# EasyEDA Pro project 步进电机驱动器.eprj, schematic 1.2.1

## Sheets
1 主控: Board Name: Board2; Create Date: 2025-08-29; Page Name: 主控; Project Name: 步进电机驱动器; Schematic Name: Schematic2; Update Date: 2025-08-29; Company: 嘉立创EDA; Page Size: A4; Version: V1.0
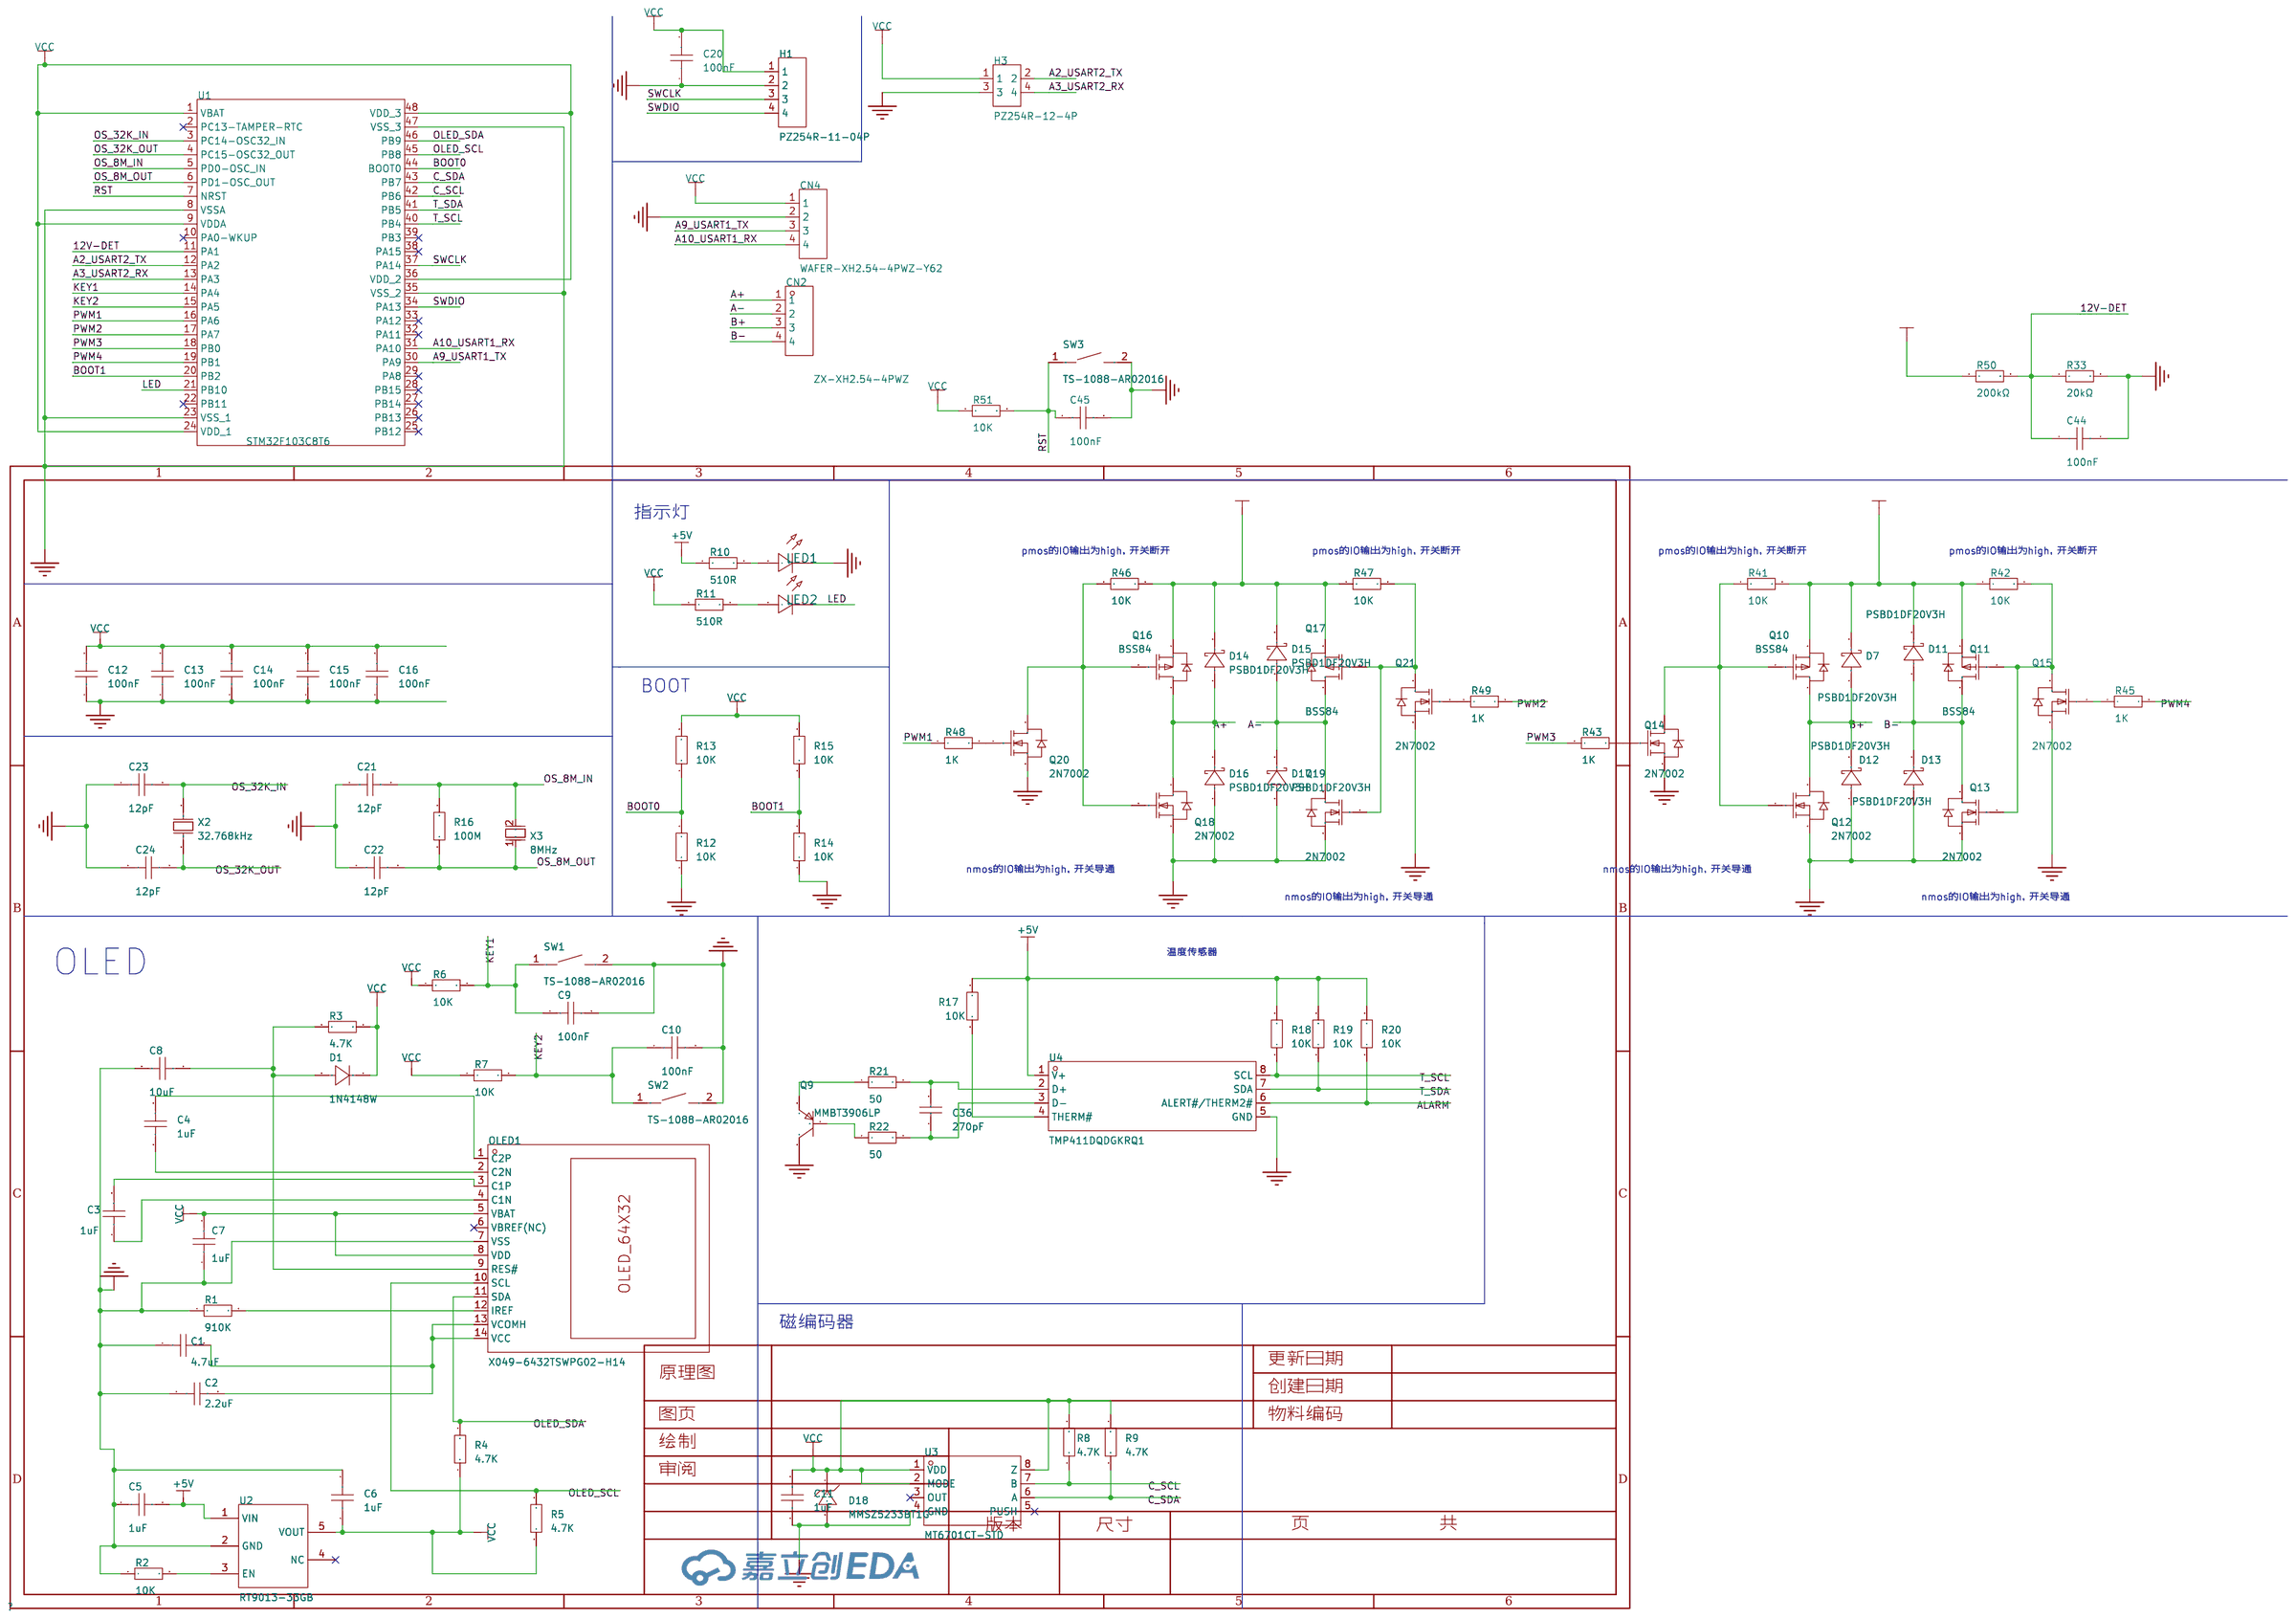
[diagram p2: 主控]
2 电源: Board Name: 1.1.2; Page Name: 电源
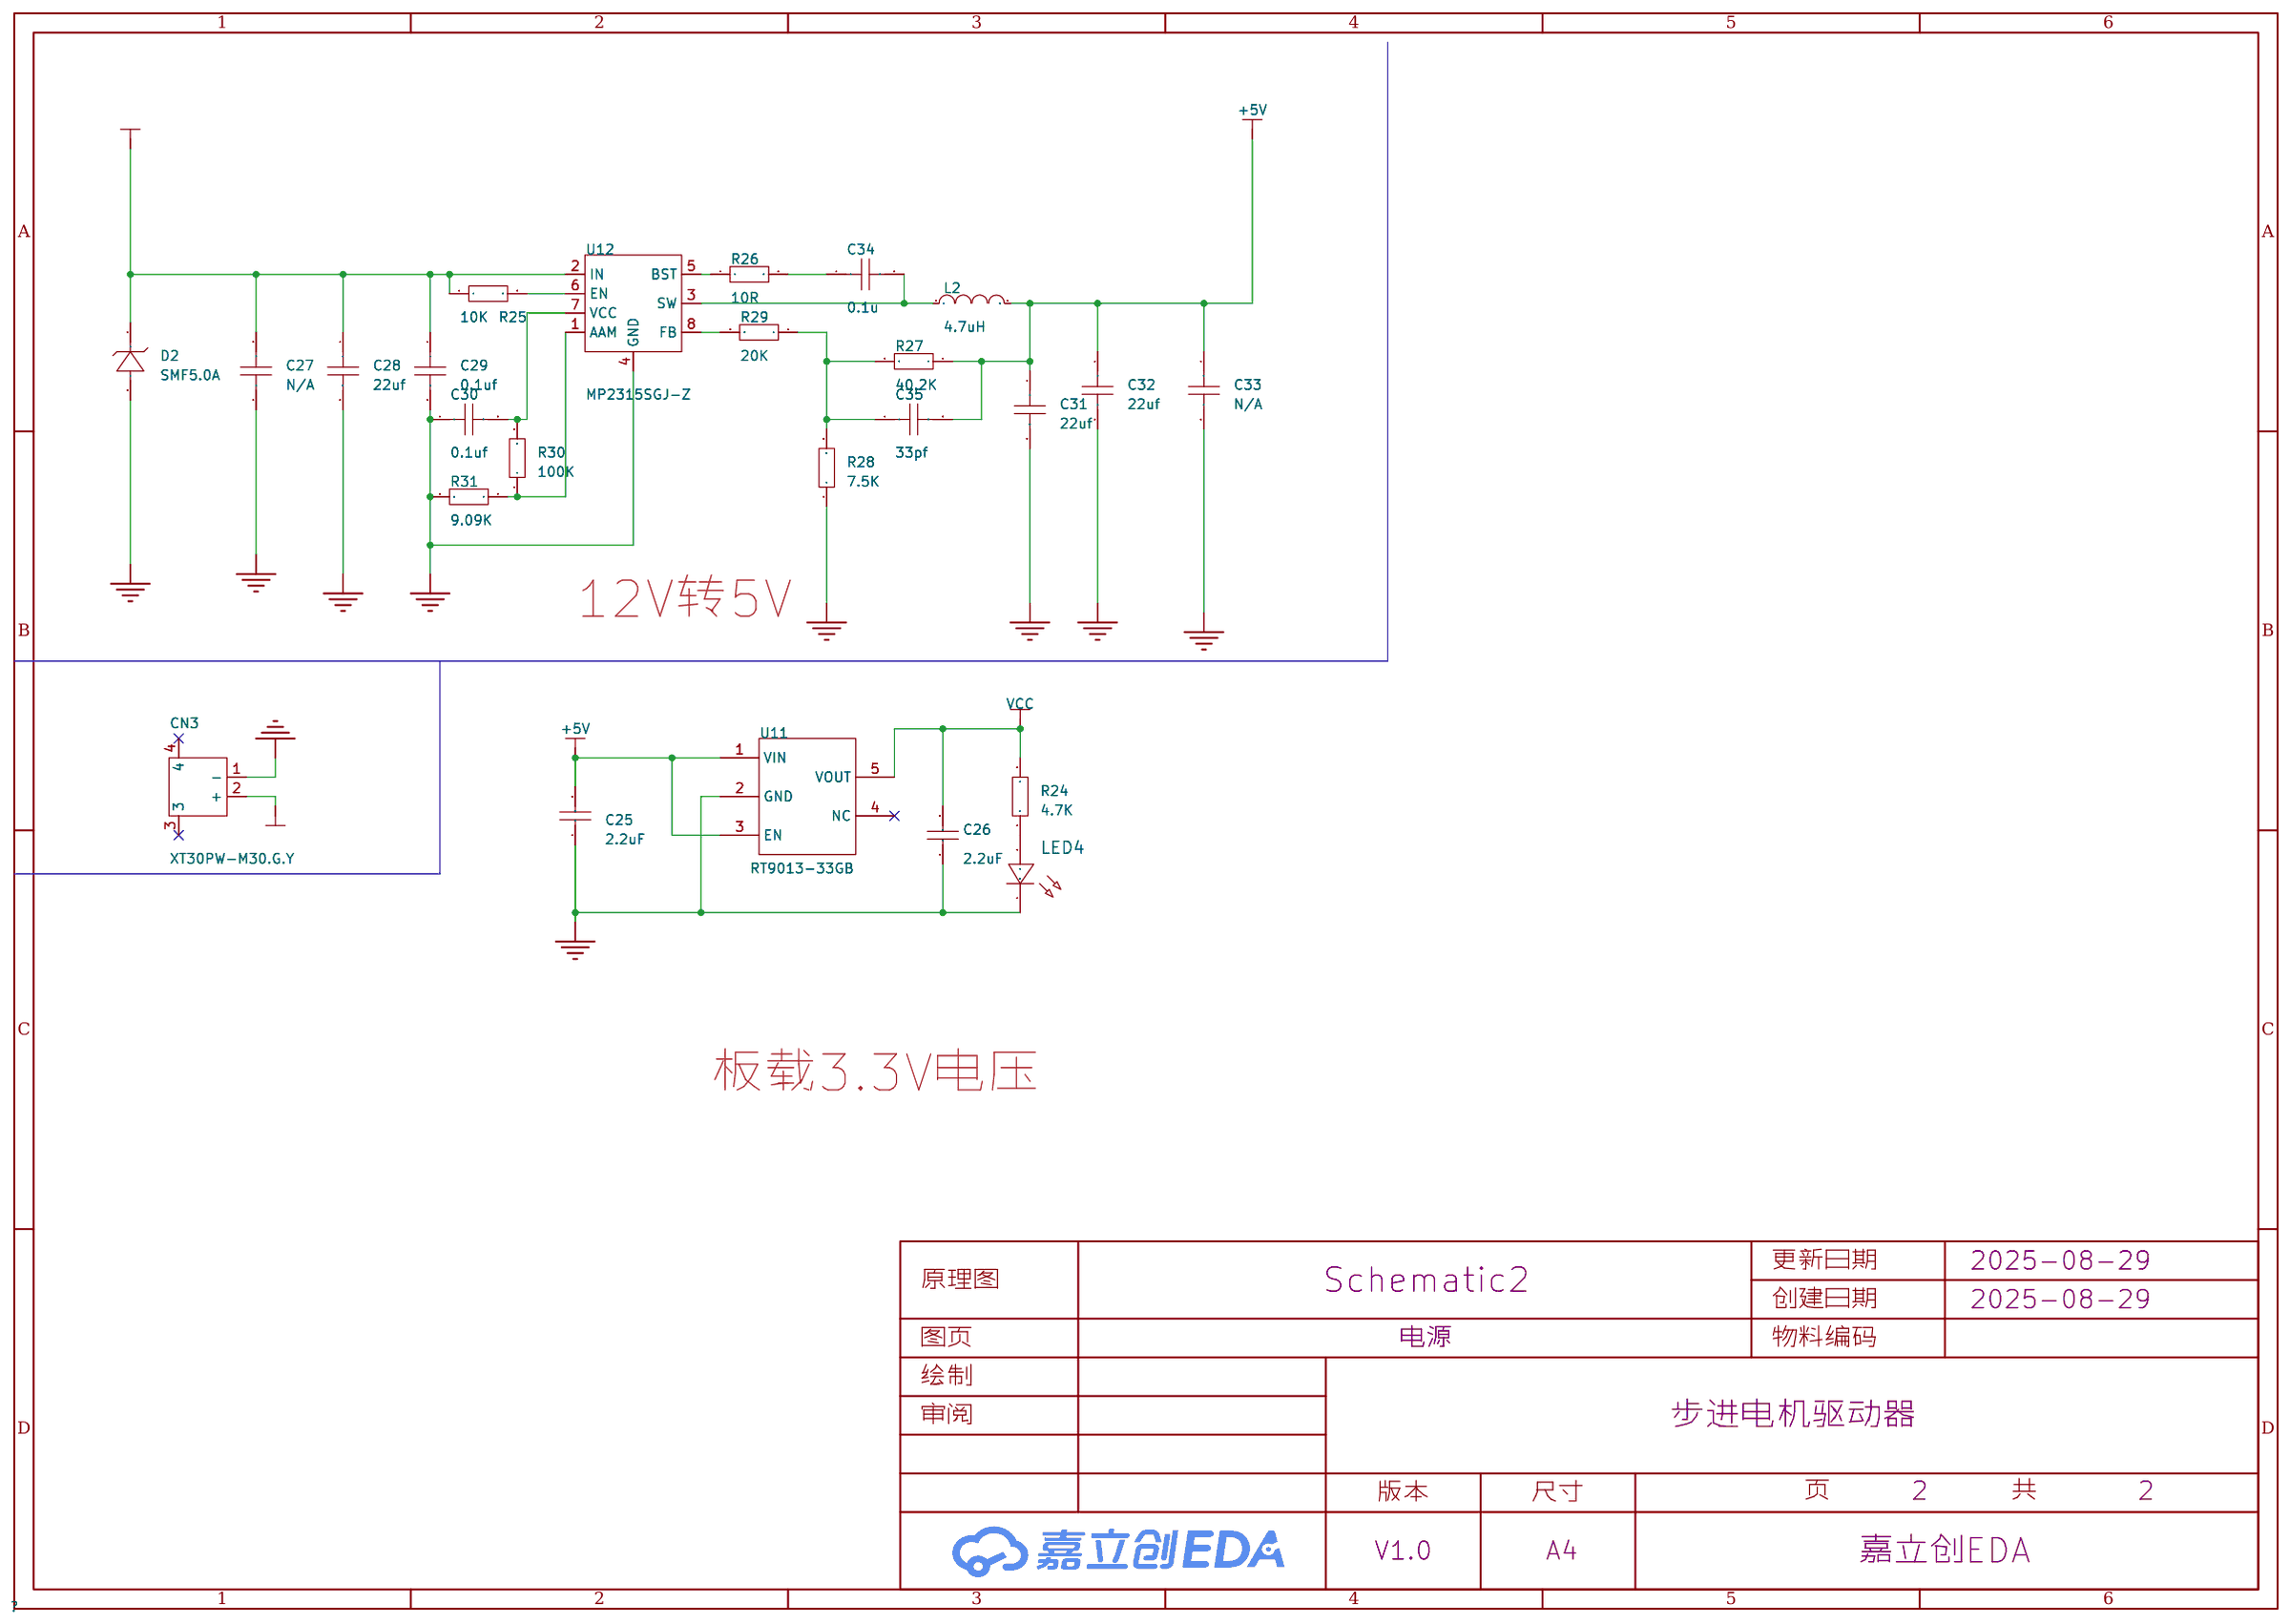
[diagram p3: 电源]

## Parts
sheet 主控
C1  4.7uF  [C0603]
C2  2.2uF  [C0603]
C3  1uF  [C0603]
C4  1uF  [C0603]
C5  1uF  [C0603]
C6  1uF  [C0603]
C7  1uF  [C0603]
C8  10uF  [C0603]
C9  100nF  [C0603]
C10  100nF  [C0603]
C11  1uF  [C0603]
C12  100nF  [C0603]
C13  100nF  [C0603]
C14  100nF  [C0603]
C15  100nF  [C0603]
C16  100nF  [C0603]
C20  100nF  [C0603]
C21  12pF  [C0603]
C22  12pF  [C0603]
C23  12pF  [C0603]
C24  12pF  [C0603]
C36  270pF  [C0603]
C44  100nF  [C0603]
C45  100nF  [C0603]
CN2  ZX-XH2.54-4PWZ  [CONN-TH_4P-P2.50_ZX-XH2.54-4PWZ]
CN4  WAFER-XH2.54-4PWZ-Y62  [CONN-TH_4P-P2.50_WAFER-XH2.54-4PWZ]
D1  1N4148W  [SOD-123_L2.7-W1.6-LS3.8-RD]
D7  PSBD1DF20V3H  [SOD-123F_L2.8-W1.8-LS3.7-RD]
D11  PSBD1DF20V3H  [SOD-123F_L2.8-W1.8-LS3.7-RD]
D12  PSBD1DF20V3H  [SOD-123F_L2.8-W1.8-LS3.7-RD]
D13  PSBD1DF20V3H  [SOD-123F_L2.8-W1.8-LS3.7-RD]
D14  PSBD1DF20V3H  [SOD-123F_L2.8-W1.8-LS3.7-RD]
D15  PSBD1DF20V3H  [SOD-123F_L2.8-W1.8-LS3.7-RD]
D16  PSBD1DF20V3H  [SOD-123F_L2.8-W1.8-LS3.7-RD]
D17  PSBD1DF20V3H  [SOD-123F_L2.8-W1.8-LS3.7-RD]
D18  MMSZ5233BT1G  [SOD-123_L2.7-W1.6-LS3.7-RD]
H1  PZ254R-11-04P  [HDR-TH_4P-P2.54-H-M-W10.4]
H3  PZ254R-12-4P  [HDR-TH_4P-P2.54-H-M-R2-C2-S2.54]
LED1  -  [LED_0603]
LED2  -  [LED_0603]
OLED1  X049-6432TSWPG02-H14  [OLED-SMD_X049-6432TSWPG02-H14]
Q9  MMBT3906LP  [X1-DFN1006-3_L1.0-W0.6-P0.35-BR]
Q10  BSS84  [SOT-23-3_L2.9-W1.3-P1.90-LS2.4-BR-1]
Q11  BSS84  [SOT-23-3_L2.9-W1.3-P1.90-LS2.4-BR-1]
Q12  2N7002  [SOT-23-3_L2.9-W1.3-P1.90-LS2.4-BR]
Q13  2N7002  [SOT-23-3_L2.9-W1.3-P1.90-LS2.4-BR]
Q14  2N7002  [SOT-23-3_L2.9-W1.3-P1.90-LS2.4-BR]
Q15  2N7002  [SOT-23-3_L2.9-W1.3-P1.90-LS2.4-BR]
Q16  BSS84  [SOT-23-3_L2.9-W1.3-P1.90-LS2.4-BR-1]
Q17  BSS84  [SOT-23-3_L2.9-W1.3-P1.90-LS2.4-BR-1]
Q18  2N7002  [SOT-23-3_L2.9-W1.3-P1.90-LS2.4-BR]
Q19  2N7002  [SOT-23-3_L2.9-W1.3-P1.90-LS2.4-BR]
Q20  2N7002  [SOT-23-3_L2.9-W1.3-P1.90-LS2.4-BR]
Q21  2N7002  [SOT-23-3_L2.9-W1.3-P1.90-LS2.4-BR]
R1  910K  [R0603]
R2  10K  [R0603]
R3  4.7K  [R0603]
R4  4.7K  [R0603]
R5  4.7K  [R0603]
R6  10K  [R0603]
R7  10K  [R0603]
R8  4.7K  [R0603]
R9  4.7K  [R0603]
R10  510R  [R0603]
R11  510R  [R0603]
R12  10K  [R0603]
R13  10K  [R0603]
R14  10K  [R0603]
R15  10K  [R0603]
R16  100M  [R0603]
R17  10K  [R0603]
R18  10K  [R0603]
R19  10K  [R0603]
R20  10K  [R0603]
R21  50  [R0603]
R22  50  [R0603]
R33  20kΩ  [R0603]
R41  10K  [R0603]
R42  10K  [R0603]
R43  1K  [R0603]
R45  1K  [R0603]
R46  10K  [R0603]
R47  10K  [R0603]
R48  1K  [R0603]
R49  1K  [R0603]
R50  200kΩ  [R0603]
R51  10K  [R0603]
SW1  TS-1088-AR02016  [SW-SMD_L3.9-W3.0-P4.45]
SW2  TS-1088-AR02016  [SW-SMD_L3.9-W3.0-P4.45]
SW3  TS-1088-AR02016  [SW-SMD_L3.9-W3.0-P4.45]
U1  STM32F103C8T6  [LQFP-48_L7.0-W7.0-P0.50-LS9.0-BL]
U2  RT9013-33GB  [SOT-23-5_L3.0-W1.7-P0.95-LS2.8-BL]
U3  MT6701CT-STD  [SOP-8_L4.9-W3.9-P1.27-LS6.0-BL]
U4  TMP411DQDGKRQ1  [VSSOP-8_L3.0-W3.0-P0.65-LS4.9-BL]
X2  32.768kHz  [CRYSTAL-SMD_L3.2-W1.5-1]
X3  8MHz  [OSC-SMD_2P-L3.2-W2.5]
sheet 电源
C25  2.2uF  [C0603]
C26  2.2uF  [C0603]
C27  N/A  [C0603]
C28  22uf  [C0603]
C29  0.1uf  [C0603]
C30  0.1uf  [C0603]
C31  22uf  [C0603]
C32  22uf  [C0603]
C33  N/A  [C0603]
C34  0.1u  [C0603]
C35  33pf  [C0603]
CN3  XT30PW-M30.G.Y  [CONN-TH_XT30PW-M]
D2  SMF5.0A  [SOD-123FL_L2.7-W1.8-LS3.8-RD]
L2  4.7uH  [IND-SMD_L4.4-W4.2]
LED4  -  [LED_0603]
R24  4.7K  [R0603]
R25  10K  [R0603]
R26  10R  [R0603]
R27  40.2K  [R0603]
R28  7.5K  [R0603]
R29  20K  [R0603]
R30  100K  [R0603]
R31  9.09K  [R0603]
U11  RT9013-33GB  [SOT-23-5_L3.0-W1.7-P0.95-LS2.8-BL]
U12  MP2315SGJ-Z  [TSOT-23-8_L2.9-W1.6-P0.65-LS2.8-BL]

## Library data of the parts
C1-C16 C20-C24 C27-C35 C45 = CAP_0603: Supplier Footprint: 0603
C36 = 0603B271K500NT: 容值:270pF;精度:±10%;额定电压:50V;温度系数:X7R;; LCSC Part Name: 270pF ±10% 50V; Supplier Part: C1608; Manufacturer: FH(风华); Supplier Footprint: 0603; JLCPCB Part Class: 扩展库; Datasheet: https://atta.szlcsc.com/upload/public/pdf/source/20200305/C486355_26A10D38EF8C2A5C37091D0039909270.pdf; Supplier: LCSC; Tolerance: ±10%; Voltage Rating: 50V; Temperature Coefficient: X7R
C44 = CGA0603X7R104K500JT: 容值:100nF;精度:±10%;额定电压:50V;材质(温度系数):X7R;; LCSC Part Name: 100nF ±10% 50V; Supplier Part: C6119867; Manufacturer: HRE(芯声); Supplier Footprint: 0603; JLCPCB Part Class: 扩展库; Supplier: LCSC; Tolerance: ±10%; Voltage Rated: 50V; Temperature Coefficient: X7R
CN2 = ZX-XH2.54-4PWZ: LCSC Part Name: 1x4P 间距:2.5mm 弯插 系列:XH; Supplier Part: C7429643; Manufacturer: Megastar(兆星); Supplier Footprint: 弯插,P=2.5mm; JLCPCB Part Class: 扩展库; Datasheet: https://atta.szlcsc.com/upload/public/pdf/source/20230619/8DC602C7BA46C153FF1BE89D90453879.pdf; Supplier: LCSC; Pins Structure: 1x4P; Pitch: 2.5mm; Mounting Type: 弯插; Reference Series: XH; Number of Pins: 4P; Number of Rows: 1; Number of PINs Per Row: 4; Current Rating: 3A; Contact Material: 黄铜; Contact Plating: 锡; Operating Temperature: -25℃~+85℃; Voltage Rating: 250V; Plastic Material: PA66; Flame Retardant Rating: UL94V-0; Color: 白色; Z-Height of the Board: 5.9mm; X-Length of Bottom Edge on Board (Spacing Line): 12.5mm; Y-Width of Bottom Edge on Board: 7.32mm
CN4 = WAFER-XH2.54-4PWZ-Y62: LCSC Part Name: 1x4P 间距:2.5mm 弯插 系列:XH; Supplier Part: C42441204; Manufacturer: XUNPU(讯普); Supplier Footprint: 弯插,P=2.5mm; Datasheet: https://item.szlcsc.com/datasheet/WAFER-XH2.54-4PWZ-Y62/44489235.html; Supplier: LCSC; Pins Structure: 1x4P; Pitch: 2.5mm; Mounting Type: 弯插; Reference Series: XH; Number of Pins: 4P; Number of Rows: 1; Number of PINs Per Row: 4; Current Rating: 3A; Contact Material: 铜合金; Contact Plating: 锡; Operating Temperature: -25℃~+85℃; Voltage Rating: 250V; Plastic Material: PA66; Flame Retardant Rating: UL94V-2; Color: 米色; Z-Height of the Board: 5.75mm; X-Length of Bottom Edge on Board (Spacing Line): 12.5mm; Y-Width of Bottom Edge on Board: 7.17mm
D1 = 1N4148W_C909967: 二极管配置:独立式;正向压降(Vf):1.25V@150mA;直流反向耐压(Vr):100V;整流电流:-;反向恢复时间(Trr):-;; LCSC Part Name: 电压:100V 电流:150mA; Supplier Part: C909967; Manufacturer: GOODWORK(固得沃克); Supplier Footprint: SOD-123; JLCPCB Part Class: 扩展库; Datasheet: https://atta.szlcsc.com/upload/public/pdf/source/20240802/BA80D71F54142D28B058A528BF89B76A.pdf; Supplier: LCSC; Diode Configuration: 独立式; Voltage - Forward(Vf@If): 1.25V@150mA; Voltage - DC Reverse(Vr): 100V; Reverse Leakage Current (Ir): 1uA@100V; Operating Temperature: -55℃~+150℃@(Tj)
D7 D11-D17 = PSBD1DF20V3H: Supplier Part: C110729; Manufacturer: Prisemi(芯导); Supplier Footprint: SOD-123F; JLCPCB Part Class: Extended Part; Datasheet: https://item.szlcsc.com/datasheet/PSBD1DF20V3H/111954.html; Supplier: LCSC; Voltage - Forward(Vf@If): 550mV@1A; Voltage - DC Reverse(Vr): 20V; Current - Rectified: 3A; Reverse Leakage Current (Ir): 500uA@20V; Operating Junction Temperature Range: -55℃~+150℃@(Tj); Non-Repetitive Peak Forward Surge Current: 80A
D18 = MMSZ5233BT1G: Supplier Part: C145506; Manufacturer: onsemi(安森美); Supplier Footprint: SOD-123; JLCPCB Part Class: 扩展库; Datasheet: https://item.szlcsc.com/datasheet/MMSZ5233BT1G/156838.html; Supplier: LCSC; Diode Configuration: 独立式; Zener Voltage(Nom): 6V; Reverse Leakage Current (Ir): 5uA@3.5V; Zener Voltage(Range): 5.7V~6.3V; Pd - Power Dissipation: 500mW; Impedance(Zzt): 7Ω; Impedance(Zzk): 1.6kΩ; Operating Junction Temperature Range: -55℃~+150℃
H1 = PZ254R-11-04P: 插针结构:1x4P;间距:2.54mm;行距:-;圆针/方针:方针;安装方式:弯插;排数:单排;总PIN位数:4P;额定电流:-;额定电压:-;配合针长度:6mm;塑高:2.5mm;触头材质:黄铜;触头镀层:-;工作温度:-40℃~+105℃;颜色:黑色;; LCSC Part Name: 1x4P 间距:2.54mm 方针 弯插; Supplier Part: C492412; Manufacturer: XFCN(兴飞); Supplier Footprint: 弯插,P=2.54mm; JLCPCB Part Class: 扩展库; Datasheet: https://atta.szlcsc.com/upload/public/pdf/source/20200309/C492412_B0EFFC1946AB079B8871416C4A09EF6C.pdf; Supplier: LCSC; Pin Structure: 1x4P; Pitch: 2.54mm; Circluar Pins/Square Pins: 方针; Mounting Type: 弯插; Number of Rows: 单排; Number of Pins: 4P; Length of Mating Pin: 6mm; Insulation Height: 2.5mm; Contact Material: 黄铜; Operating Temperature: -40℃~+105℃; Color: 黑色
H3 = PZ254R-12-4P: 插针结构:2x2P;间距:2.54mm;行距:2.54mm;圆针/方针:方针;安装方式:弯插;排数:双排;总PIN位数:4P;额定电流:-;额定电压:-;配合针长度:6mm;塑高:2.5mm;触头材质:黄铜;触头镀层:-;工作温度:-40℃~+105℃;颜色:黑色;; LCSC Part Name: 2x2P 间距:2.54mm 方针 弯插; Supplier Part: C492430; Manufacturer: XFCN(兴飞); Supplier Footprint: 弯插,P=2.54mm; JLCPCB Part Class: 扩展库; Datasheet: https://atta.szlcsc.com/upload/public/pdf/source/20200309/C492430_40F61060098E2A512B5822C8CF53ABE1.pdf; Supplier: LCSC; Pin Structure: 2x2P; Pitch: 2.54mm; Row Spacing: 2.54mm; Circluar Pins/Square Pins: 方针; Mounting Type: 弯插; Number of Rows: 双排; Number of Pins: 4P; Length of Mating Pin: 6mm; Insulation Height: 2.5mm; Contact Material: 黄铜; Operating Temperature: -40℃~+105℃; Color: 黑色
LED1 LED2 LED4 = LED_0603-R: Supplier Footprint: 0603
OLED1 = X049-6432TSWPG02-H14: 显示屏; Supplier Part: C18723009; Manufacturer: Newvision(新智景); JLCPCB Part Class: 扩展库; Datasheet: https://atta.szlcsc.com/upload/public/pdf/source/20231103/4FD7F1160504D84EC5B2CD699B288E83.pdf; Supplier: LCSC
Q9 = MMBT3906LP: 晶体管类型:PNP;集电极电流(Ic):200mA;集射极击穿电压(Vceo):40V;耗散功率(Pd):200mW;直流电流增益(hFE):300@10mA,1V;; LCSC Part Name: PNP 电流:200mA 电压:40V; Supplier Part: C19089401; Manufacturer: YONGYUTAI(永裕泰); Supplier Footprint: DFN1006-3L; JLCPCB Part Class: 扩展库; Datasheet: https://item.szlcsc.com/datasheet/MMBT3906LP/20296712.html; Supplier: LCSC; type: PNP; Current - Collector(Ic): 200mA; Collector - Emitter Voltage VCEO: 40V; Pd - Power Dissipation: 200mW; DC Current Gain: 300@10mA,1V; Transition frequency(fT): 300MHz; Current - Collector Cutoff: 100nA; Vce Saturation(VCE(sat)): 300mV@50mA,5mA; Operating Temperature: -55℃~+150℃; Emitter-Base Voltage(Vebo): 5V; Number: 1个PNP
Q10 Q11 Q16 Q17 = BSS84_C7420340: LCSC Part Name: P沟道,电流:-0.17A,耐压:-60V; Supplier Part: C7420340; Manufacturer: 宏嘉诚; Supplier Footprint: SOT-23; JLCPCB Part Class: 扩展库; Datasheet: https://atta.szlcsc.com/upload/public/pdf/source/20250624/B9A20CA6774225BD9E2FC0CF094F2968.pdf; Supplier: LCSC; Number: 1个P沟道; Drain to Source Voltage: 60V; Current - Continuous Drain(Id): 170mA; RDS(on): 3.3Ω@10V；3.5Ω@4.5V; Pd - Power Dissipation: 680mW; Gate Threshold Voltage (Vgs(th)): 1.4V@250uA; Gate Charge(Qg): 1.77nC@10V; Input Capacitance(Ciss): 43pF; Reverse Transfer Capacitance (Crss@Vds): 2.8pF; Operating Temperature: -55℃~+150℃; Type: P沟道; Output Capacitance(Coss): 2.9pF
Q12-Q15 Q18-Q21 = 2N7002_C7420321: LCSC Part Name: N沟道,电流:115mA,耐压:60V; Supplier Part: C7420321; Manufacturer: 宏嘉诚; Supplier Footprint: SOT-23; JLCPCB Part Class: 扩展库; Datasheet: https://atta.szlcsc.com/upload/public/pdf/source/20250624/B1032C791A504786E484C5C5C9138B03.pdf; Supplier: LCSC; Number: 1个N沟道; Drain to Source Voltage: 60V; Current - Continuous Drain(Id): 115mA; RDS(on): 900mΩ@10V; Pd - Power Dissipation: 225mW; Gate Threshold Voltage (Vgs(th)): 1.6V@250uA; Gate Charge(Qg): 1.6nC@10V; Input Capacitance(Ciss): 50pF; Reverse Transfer Capacitance (Crss@Vds): 5pF; Operating Temperature: -55℃~+150℃; Type: N沟道; Output Capacitance(Coss): 25pF
R1-R22 R24-R31 R41-R43 R45-R49 R51 = Res_0603: Supplier Footprint: 0603
R33 = 0603WAF2002T5E: 电阻类型:厚膜电阻;阻值:20kΩ;精度:±1%;功率:100mW;最大工作电压:75V;温度系数:±100ppm/℃;; LCSC Part Name: 20kΩ ±1% 100mW 厚膜电阻; Supplier Part: C4184; Manufacturer: UNI-ROYAL(厚声); Supplier Footprint: 0603; JLCPCB Part Class: 基础库; Datasheet: https://atta.szlcsc.com/upload/public/pdf/source/20200306/C422600_1E6D84923E4A46A82E41ADD87F860B5C.pdf; Supplier: LCSC; Type: 厚膜电阻; Tolerance: ±1%; Power(Watts): 100mW; Overload Voltage (Max): 75V; Temperature Coefficient: ±100ppm/℃; Operating Temperature Range: -55℃~+155℃
R50 = 0603WAF2003T5E: 电阻类型:厚膜电阻;阻值:200kΩ;精度:±1%;功率:100mW;最大工作电压:75V;温度系数:±100ppm/℃;; LCSC Part Name: 200kΩ ±1% 100mW 厚膜电阻; Supplier Part: C25811; Manufacturer: UNI-ROYAL(厚声); Supplier Footprint: 0603; JLCPCB Part Class: 基础库; Datasheet: https://atta.szlcsc.com/upload/public/pdf/source/20200306/C422600_1E6D84923E4A46A82E41ADD87F860B5C.pdf; Supplier: LCSC; Type: 厚膜电阻; Tolerance: ±1%; Power(Watts): 100mW; Overload Voltage (Max): 75V; Temperature Coefficient: ±100ppm/℃; Operating Temperature Range: -55℃~+155℃
SW1-SW3 = TS-1088-AR02016: 电路结构:单刀单掷;按钮形状:圆形按钮;作用力:160gf;安装方式:立贴;开关长度:4mm;开关宽度:3mm;开关高度:2mm;带支架:不带;触点电流:50mA;额定电压(DC):12V;绝缘电阻:100MΩ;机械寿命:10万次;; LCSC Part Name: 4*3*2mm 立贴 轻触开关; Supplier Part: C720477; Manufacturer: XUNPU(讯普); Supplier Footprint: SMD; JLCPCB Part Class: 基础库; Datasheet: https://atta.szlcsc.com/upload/public/pdf/source/20200810/C720475_60D09DD6C54279ADDB2DC25100F1CC11.pdf; Supplier: LCSC; Circuit: 单刀单掷; Actuator Style: 圆形按钮; Operating Force: 160gf; Mounting Style: 立贴; Switch Length: 4mm; Switch Width: 3mm; Switch Height: 2mm; Strike Gundam: 不带; Contact Current: 50mA; Voltage Rating (DC): 12V; Insulation Resistance: 100MΩ; Actuator/Cap Color: 黑色; Pin Style: SMD接片; Mechanical Life: 10万次; Operating Temperature: -30℃~+80℃
U1 = STM32F103C8T6: CPU内核:ARM-M3;CPU最大主频:72MHz;应用领域:-;; LCSC Part Name: 主流增强型ARM Cortex-M3 MCU，具有64 KB Flash、72 MHz CPU、电机控制、USB和CAN; Supplier Part: C8734; Manufacturer: ST(意法半导体); Supplier Footprint: LQFP-48(7x7); JLCPCB Part Class: 扩展库; Datasheet: https://item.szlcsc.com/datasheet/STM32F103C8T6/9243.html; Supplier: LCSC; CPU Core: ARM-M3; CPU Maximum Speed: 72MHz; Program Storage Size: 64KB; Program Memory Type: FLASH; Number of I/O: 37; ADC (Bit): 12bit; Voltage - Supply: 2V~3.6V
U2 = RT9013-33GB: 输出类型:固定;工作电压:5.5V;输出电压:3.3V;输出电流:500mA;电源纹波抑制比(PSRR):50dB@(10kHz);输出极性:正极;; LCSC Part Name: 输入5.5V 输出3.3V 500mA; Supplier Part: C47773; Manufacturer: RICHTEK(立锜); Supplier Footprint: SOT-23-5; JLCPCB Part Class: 扩展库; Datasheet: https://atta.szlcsc.com/upload/public/pdf/source/20150504/1457707282459.pdf; Supplier: LCSC; Output Type: 固定; Voltage - Supply: 5.5V; Output Voltage: 3.3V; Output Current: 500mA; Power Supply Rejection Ratio (PSRR): 50dB@(10kHz); Voltage Dropout: 400mV@(500mA); standby current: 25uA; Noise: 30uVrms; Features: 带使能；过热保护；过流保护; Operating Temperature: -40℃~+125℃@(Tj); Output Configuration: 正极; Number of Outputs: 1
U3 = MT6701CT-STD_C5451785: Supplier Part: C5451785; Manufacturer: MagnTek(麦歌恩); Supplier Footprint: SOP-8; JLCPCB Part Class: 扩展库; Datasheet: https://item.szlcsc.com/datasheet/MT6701CT-STD/6356029.html; Supplier: LCSC
U4 = TMP411DQDGKRQ1: TMP411-Q1 具有 N 因数和串联电阻校正的汽车级、远程和本地温度传感器; Supplier Part: C2859856; Manufacturer: TI(德州仪器); Supplier Footprint: VSSOP-8-0.65mm; JLCPCB Part Class: 扩展库; Datasheet: https://www.ti.com/cn/lit/gpn/tmp411-q1; Supplier: LCSC
X2 = CM7V-T1A-LOW-ESR-32.768K-12.5PF-20-TA-QC: 频率:32.768kHz;常温频差:±20ppm;负载电容:12.5pF;频率稳定度:-;; LCSC Part Name: CM7V-T1A LOW ESR 32.768K 12.5PF 20 TA QC; Supplier Part: C27152053; Manufacturer: Micro Crystal(瑞士微晶); Supplier Footprint: SMD3215; JLCPCB Part Class: 扩展库; Datasheet: https://www.microcrystal.com/fileadmin/Media/Products/32kHz/Datasheet/CM7V-T1A_Low-ESR.pdf; Supplier: LCSC; Normal temperature Frequency Tolerance: ±20ppm; Load Capacitance: 12.5pF; Operating Temperature: -40℃~+85℃
X3 = A308000003: 晶振类型:贴片晶振;频率:8MHz;常温频差:±30ppm;负载电容:12pF;; LCSC Part Name: FL:8M CL:12.0 FT:30 OP:-40TO~125 ST:100 CI:300 DL:10(100Max); Supplier Part: C409345; Manufacturer: TXC(晶技); Supplier Footprint: SMD3225; JLCPCB Part Class: 扩展库; Datasheet: https://atta.szlcsc.com/upload/public/pdf/source/20240312/351197091BF4DB9A6E687BFC8ED82776.pdf; Supplier: LCSC; Type: 贴片晶振; Normal temperature Frequency Tolerance: ±30ppm; Load Capacitance: 12pF; Equivalent Series Resistance(ESR): 300Ω; Operating Temperature: -40℃~+125℃
C25 C26 = 0603B104K500NT: 容值:100nF;精度:±10%;额定电压:50V;材质(温度系数):X7R;; LCSC Part Name: 100nF ±10% 50V; Supplier Part: C30926; Manufacturer: FH(风华); Supplier Footprint: 0603; JLCPCB Part Class: 扩展库; Datasheet: https://atta.szlcsc.com/upload/public/pdf/source/20170923/C30926_1506149436298988724.pdf; Supplier: LCSC; Tolerance: ±10%; Voltage Rated: 50V; Temperature Coefficient: X7R
CN3 = XT30PW-M30.G.Y: 类别:-;类型1:-;; LCSC Part Name: AMASS(艾迈斯)航模插头 卧式弯脚 XT30PW-M公头; Supplier Part: C431092; Manufacturer: AMASS(艾迈斯); JLCPCB Part Class: 扩展库; Datasheet: https://item.szlcsc.com/datasheet/XT30PW-M30.G.Y/426930.html; Supplier: LCSC; Type: 航模插头; RatedVoltage: DC 500V; InterfaceType: 公头; RatedCurrent: 15A; RecommendedWireGauge: 16/18/20AWG; contact resistance: 1.2mΩ; specifications: 2pin
D2 = SMF5.0A_C19077497: 极性:单向;反向截止电压(Vrwm):5V;最大钳位电压:7.3V;峰值脉冲电流(Ipp):27.4A;峰值脉冲功率(Ppp):200W;击穿电压:6.4V;; Supplier Part: C19077497; Manufacturer: 宏迦橙; Supplier Footprint: SOD-123FL; JLCPCB Part Class: 扩展库; Datasheet: https://atta.szlcsc.com/upload/public/pdf/source/20231129/4813F17DC56F8B344A8D004597B3633C.pdf; Supplier: LCSC; polarity: 单向; Reverse Stand-Off Voltage (Vrwm): 5V; Maximum Clamping Voltage: 7.3V; Peak Pulse Current (Ipp): 27.4A; Peak Pulse Power Dissipation (Ppp): 200W; Breakdown Voltage: 6.4V; Reverse Leakage Current (Ir): 400uA; Number of Lines: 单路; Operating Temperature: -55℃~+155℃; Type: TVS
L2 = FXL0420-4R7-M: 电感值:4.7uH;精度:±20%;额定电流:2.8A;饱和电流(Isat):3A;类型:一体成型电感;; LCSC Part Name: 4.7uH ±20% 3A; Supplier Part: C167208; Manufacturer: cjiang(长江微电); Supplier Footprint: SMD,4.2x4.4mm; JLCPCB Part Class: 扩展库; Datasheet: https://atta.szlcsc.com/upload/public/pdf/source/20240426/3189EA8206330E2108542F9E34E540E7.pdf; Supplier: LCSC; Tolerance: ±20%; Rated Current: 2.8A; Saturation Current (Isat): 3A; DC Resistance (DCR): 105mΩ; Type: 一体成型电感
U11 = RT9013-33GB: 输出类型:固定;工作电压:5.5V;输出电压:3.3V;输出电流:500mA;电源纹波抑制比(PSRR):50dB@(10kHz);输出极性:正极;; LCSC Part Name: 输入5.5V 输出3.3V 500mA; Supplier Part: C47773; Manufacturer: RICHTEK(立锜); Supplier Footprint: SOT-23-5; JLCPCB Part Class: 扩展库; Datasheet: https://atta.szlcsc.com/upload/public/pdf/source/20150504/1457707282459.pdf; Supplier: LCSC; Output Type: 固定; Voltage - Supply: 5.5V; Output Voltage: 3.3V; Output Current: 500mA; Power Supply Rejection Ratio (PSRR): 50dB@(10kHz); Voltage Dropout: 400mV@(500mA); standby current: 25uA; Noise: 30uVrms; Features: 带使能；过热保护；过流保护; Operating Temperature: -40℃~+125℃@(Tj); Output Configuration: 正极; Number of Outputs: 1; Output Polarity: 正; Maximum Input Voltage: 5.5V; Dropout Voltage: 400mV@(500mA); Quiescent Current (Ground Current): 50uA
U12 = MP2315SGJ-Z: 功能类型:降压型;输出类型:固定;工作电压:4.5V~24V;输出电压:800mV~22.8V;输出电流:3A;; LCSC Part Name: 3A、24V、500kHz高效同步降压转换器; Supplier Part: C3031493; Manufacturer: MPS(芯源); Supplier Footprint: TSOT-23-8; JLCPCB Part Class: 扩展库; Datasheet: https://atta.szlcsc.com/upload/public/pdf/source/20250306/6947E43CF096EA5EF0087E1884EF0D8F.pdf; Supplier: LCSC; Function: 降压型; Output Type: 固定; Voltage - Supply: 4.5V~24V; Output Voltage: 800mV~22.8V; Output Current: 3A; Frequency - Switching: 500kHz; Operating Temperature: -40℃~+125℃; Synchronous Rectifier: 是; Number of Outputs: 1; Topology: 降压式; Quiescent Current: 120uA; Switch tube (built-in/external): 内置

## Nets
12V: C27.2 C28.1 C29.1 CN3.2(+) D2.1(K) D7.2(K) D11.2(K) D14.2(K) D15.2(K) Q10.2(S) Q11.2(S) Q16.2(S) Q17.2(S) R25.1 R41.2 R42.1 R46.2 R47.1 R50.1 U12.2(IN)
12V-DET: C44.1 R33.1 R50.2 U1.11(PA1)
+5V: C5.2 C25.2 C31.1 C32.1 C33.1 C35.2 L2.2 R10.1 R17.1 R18.2 R19.2 R20.2 R27.1 U2.1(VIN) U4.1(V+) U11.1(VIN) U11.3(EN)
GND: C1.1 C2.1 C5.1 C6.2 C7.1 C8.2 C9.2 C10.2 C11.1 C12.1 C13.1 C14.1 C15.1 C16.1 C20.1 C21.1 C22.1 C23.1 C24.1 C25.1 C26.1 C27.1 C28.2 C29.2 C30.1 C31.2 C32.2 C33.2 C44.2 C45.2 CN3.1(-) CN4.2 D2.2(A) D12.1(A) D13.1(A) D16.1(A) D17.1(A) D18.2(A) H1.2 H3.3 LED1.1(C) LED4.1(C) OLED1.7(VSS) Q9.3(C) Q12.2(S) Q13.2(S) Q14.2(S) Q15.2(S) Q18.2(S) Q19.2(S) Q20.2(S) Q21.2(S) R1.1 R2.1 R12.1 R14.1 R28.1 R31.2 R33.2 SW1.2 SW2.2 SW3.2 U1.8(VSSA) U1.23(VSS_1) U1.35(VSS_2) U1.47(VSS_3) U2.2(GND) U3.4(GND) U4.5(GND) U11.2(GND) U12.4(GND)
VCC: C6.1 C7.2 C11.2 C12.2 C13.2 C14.2 C15.2 C16.2 C20.2 C26.2 CN4.1 D1.1(K) D18.1(C) H1.1 H3.1 OLED1.5(VBAT) OLED1.8(VDD) R3.2 R4.1 R5.1 R6.1 R7.1 R8.2 R9.2 R11.1 R13.2 R15.2 R24.2 R51.1 U1.1(VBAT) U1.9(VDDA) U1.24(VDD_1) U1.36(VDD_2) U1.48(VDD_3) U2.5(VOUT) U3.1(VDD) U3.2(MODE) U3.8(Z) U11.5(VOUT)
A2_USART2_TX: H3.2 U1.12(PA2)
A3_USART2_RX: H3.4 U1.13(PA3)
A9_USART1_TX: CN4.3 U1.30(PA9)
A10_USART1_RX: CN4.4 U1.31(PA10)
A+: CN2.1 D14.1(A) D16.2(K) Q16.3(D) Q18.3(D)
A-: CN2.2 D15.1(A) D17.2(K) Q17.3(D) Q19.3(D)
ALARM: R20.1 U4.6(ALERT#/THERM2#)
B+: CN2.3 D7.1(A) D12.2(K) Q10.3(D) Q12.3(D)
B-: CN2.4 D11.1(A) D13.2(K) Q11.3(D) Q13.3(D)
BOOT0: R12.2 R13.1 U1.44(BOOT0)
BOOT1: R14.2 R15.1 U1.20(PB2)
C_SCL: R8.1 U1.42(PB6) U3.7(B)
C_SDA: R9.1 U1.43(PB7) U3.6(A)
KEY1: C9.1 R6.2 SW1.1 U1.14(PA4)
KEY2: C10.1 R7.2 SW2.1 U1.15(PA5)
LED: LED2.1(C) U1.21(PB10)
OLED_SCL: OLED1.10(SCL) R5.2 U1.45(PB8)
OLED_SDA: OLED1.11(SDA) R4.2 U1.46(PB9)
OS_8M_IN: C21.2 R16.2 U1.5(PD0-OSC_IN) X3.2
OS_8M_OUT: C22.2 R16.1 U1.6(PD1-OSC_OUT) X3.1
OS_32K_IN: C23.2 U1.3(PC14-OSC32_IN) X2.2(OSC2)
OS_32K_OUT: C24.2 U1.4(PC15-OSC32_OUT) X2.1(OSC1)
PWM1: R48.1 U1.16(PA6)
PWM2: R49.2 U1.17(PA7)
PWM3: R43.1 U1.18(PB0)
PWM4: R45.2 U1.19(PB1)
RST: C45.1 R51.2 SW3.1 U1.7(NRST)
SWCLK: H1.3 U1.37(PA14)
SWDIO: H1.4 U1.34(PA13)
T_SCL: R18.1 U1.40(PB4) U4.8(SCL)
T_SDA: R19.1 U1.41(PB5) U4.7(SDA)
$1N769: OLED1.12(IREF) R1.2
$1N873: C1.2 C2.2 OLED1.13(VCOMH) OLED1.14(VCC)
$1N957: C4.2 OLED1.1(C2P)
$1N962: C4.1 OLED1.2(C2N)
$1N968: C3.2 OLED1.3(C1P)
$1N973: C3.1 OLED1.4(C1N)
$1N1238: R2.2 U2.3(EN)
$1N1747: C8.1 D1.2(A) OLED1.9(RES#) R3.1
$1N3678: LED1.2(A) R10.2
$1N3699: LED2.2(A) R11.2
$1N11419: R17.2 U4.4(THERM#)
$1N11428: C36.1 R22.2 U4.3(D-)
$1N11429: C36.2 R21.2 U4.2(D+)
$1N11430: Q9.2(E) R21.1
$1N11431: Q9.1(B) R22.1
$1N12162: Q10.1(G) Q12.1(G) Q14.3(D) R41.1
$1N12167: Q11.1(G) Q13.1(G) Q15.3(D) R42.2
$1N12241: Q14.1(G) R43.2
$1N12301: Q15.1(G) R45.1
$1N14197: Q16.1(G) Q18.1(G) Q20.3(D) R46.1
$1N14207: Q17.1(G) Q19.1(G) Q21.3(D) R47.2
$1N14246: Q20.1(G) R48.2
$1N14251: Q21.1(G) R49.1
$2N3717: R25.2 U12.6(EN)
$2N3722: C30.2 R30.2 U12.7(VCC)
$2N3723: C34.2 L2.1 U12.3(SW)
$2N3728: R26.1 U12.5(BST)
$2N3729: C34.1 R26.2
$2N3731: R29.2 U12.8(FB)
$2N3732: C35.1 R27.2 R28.2 R29.1
$2N3733: R30.1 R31.1 U12.1(AAM)
$2N3742: LED4.2(A) R24.1

Not connected (* = marked no-connect by the designer): CN3 3* 4*; OLED1 6(VBREF(NC))*; U1 2(PC13-TAMPER-RTC)* 10(PA0-WKUP)* 22(PB11)* 25(PB12)* 26(PB13)* 27(PB14)* 28(PB15)* 29(PA8)* 32(PA11)* 33(PA12)* 38(PA15)* 39(PB3)*; U2 4(NC)*; U3 3(OUT)* 5(PUSH)*; U11 4(NC)*

## Notes on the sheets
sheet 1
- 指示灯
- pmos的IO输出为high，开关断开
- pmos的IO输出为high，开关断开
- pmos的IO输出为high，开关断开
- pmos的IO输出为high，开关断开
- BOOT
- nmos的IO输出为high，开关导通
- nmos的IO输出为high，开关导通
- nmos的IO输出为high，开关导通
- nmos的IO输出为high，开关导通
- 温度传感器
- OLED
- 磁编码器
sheet 2
- 12V转5V
- 板载3.3V电压
